# EAGLE design tec_controller_v4 (EAGLE 7.2.0)
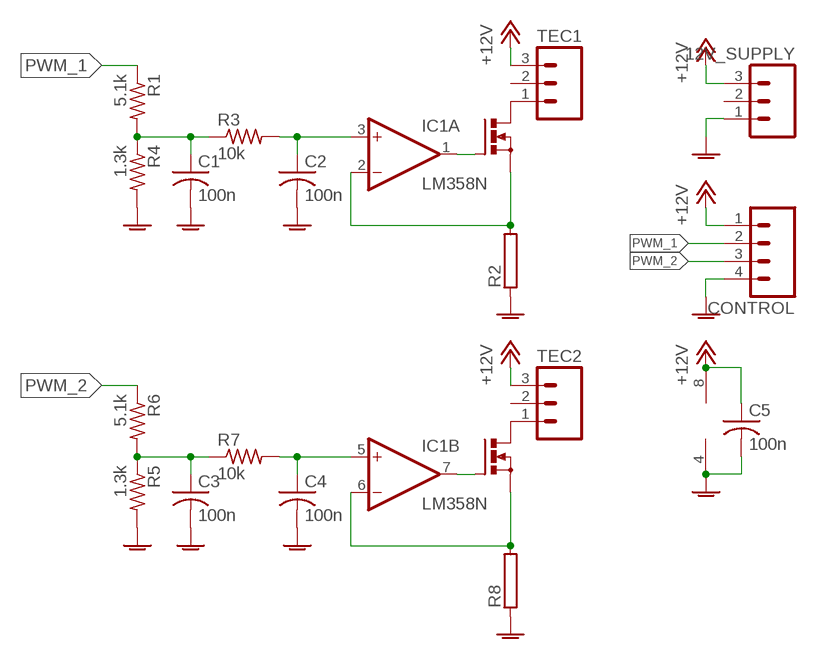
[diagram p0: schematic, sheet 1]

## Parts
12V_SUPPLY  M03POLAR  [MOLEX-1X3]
C1  100n  C-USC0805  [C0805]
C2  100n  C-USC0805  [C0805]
C3  100n  C-USC0805  [C0805]
C4  100n  C-USC0805  [C0805]
C5  100n  C-USC0805  [C0805]
CONTROL  M04POLAR  [MOLEX-1X4]
IC1  LM358N  [DIL08]
Q1  IRF512  [TO220BV]
Q2  IRF512  [TO220BV]
R1  5.1k  R-US_M0805  [M0805]
R2  RAC10  [AC10]
R3  10k  R-US_M0805  [M0805]
R4  1.3k  R-US_M0805  [M0805]
R5  1.3k  R-US_M0805  [M0805]
R6  5.1k  R-US_M0805  [M0805]
R7  10k  R-US_M0805  [M0805]
R8  RAC10  [AC10]
TEC1  M03POLAR  [MOLEX-1X3]
TEC2  M03POLAR  [MOLEX-1X3]

## Nets
+12V: 12V_SUPPLY.3 C5.1 CONTROL.1 IC1.8(P:V+) TEC1.3 TEC2.3
GNDA: 12V_SUPPLY.1 C1.2 C2.2 C3.2 C4.2 C5.2 CONTROL.4 IC1.4(P:V-) R2.1 R4.2 R5.2 R8.1
N$1: Q1.D TEC1.1
N$2: Q2.D TEC2.1
N$3: IC1.1(A:OUT) Q1.G
N$4: C1.1 R1.2 R3.1 R4.1
N$5: C2.1 IC1.3(A:+IN) R3.2
N$6: IC1.2(A:-IN) Q1.S R2.2
N$7: C3.1 R5.1 R6.2 R7.1
N$8: C4.1 IC1.5(B:+IN) R7.2
N$11: IC1.7(B:OUT) Q2.G
N$12: IC1.6(B:-IN) Q2.S R8.2
PWM_1: CONTROL.2 R1.1
PWM_2: CONTROL.3 R6.1
Unconnected: 12V_SUPPLY.2 TEC1.2 TEC2.2

## Library data of the parts
12V_SUPPLY TEC1 TEC2 = SparkFun-Connectors:M03: Header 3 Standard 3-pin 0.1" header. Use with straight break away headers (SKU : PRT-00116), right angle break away headers (PRT-00553), swiss pins (PRT-00743), machine pins (PRT-00117), and female headers (PRT-00115). Molex polarized connector foot print use with SKU : PRT-08232 with associated crimp pins and housings.
C1-C5 = rcl:C-US: CAPACITOR, American symbol
CONTROL = SparkFun-Connectors:M04: Header 4 Standard 4-pin 0.1" header. Use with straight break away headers (SKU : PRT-00116), right angle break away headers (PRT-00553), swiss pins (PRT-00743), machine pins (PRT-00117), and female headers (PRT-00115). Molex polarized connector foot print use with SKU : PRT-08231 with associated crimp pins and housings. 1MM SMD Version SKU: PRT-10208
IC1 = linear:LM358: OP AMP also LM158; LM258; LM2904 Source: http://cache.national.com/ds/LM/LM158.pdf
Q1 Q2 = transistor-power:IRF512: N-CHANNEL MOS FET
R1 R3-R7 = rcl:R-US_: RESISTOR, American symbol
R2 R8 = resistor-power:R: Power Resitor; OC_FARNELL: unknown; OC_NEWARK: unknown

## Board
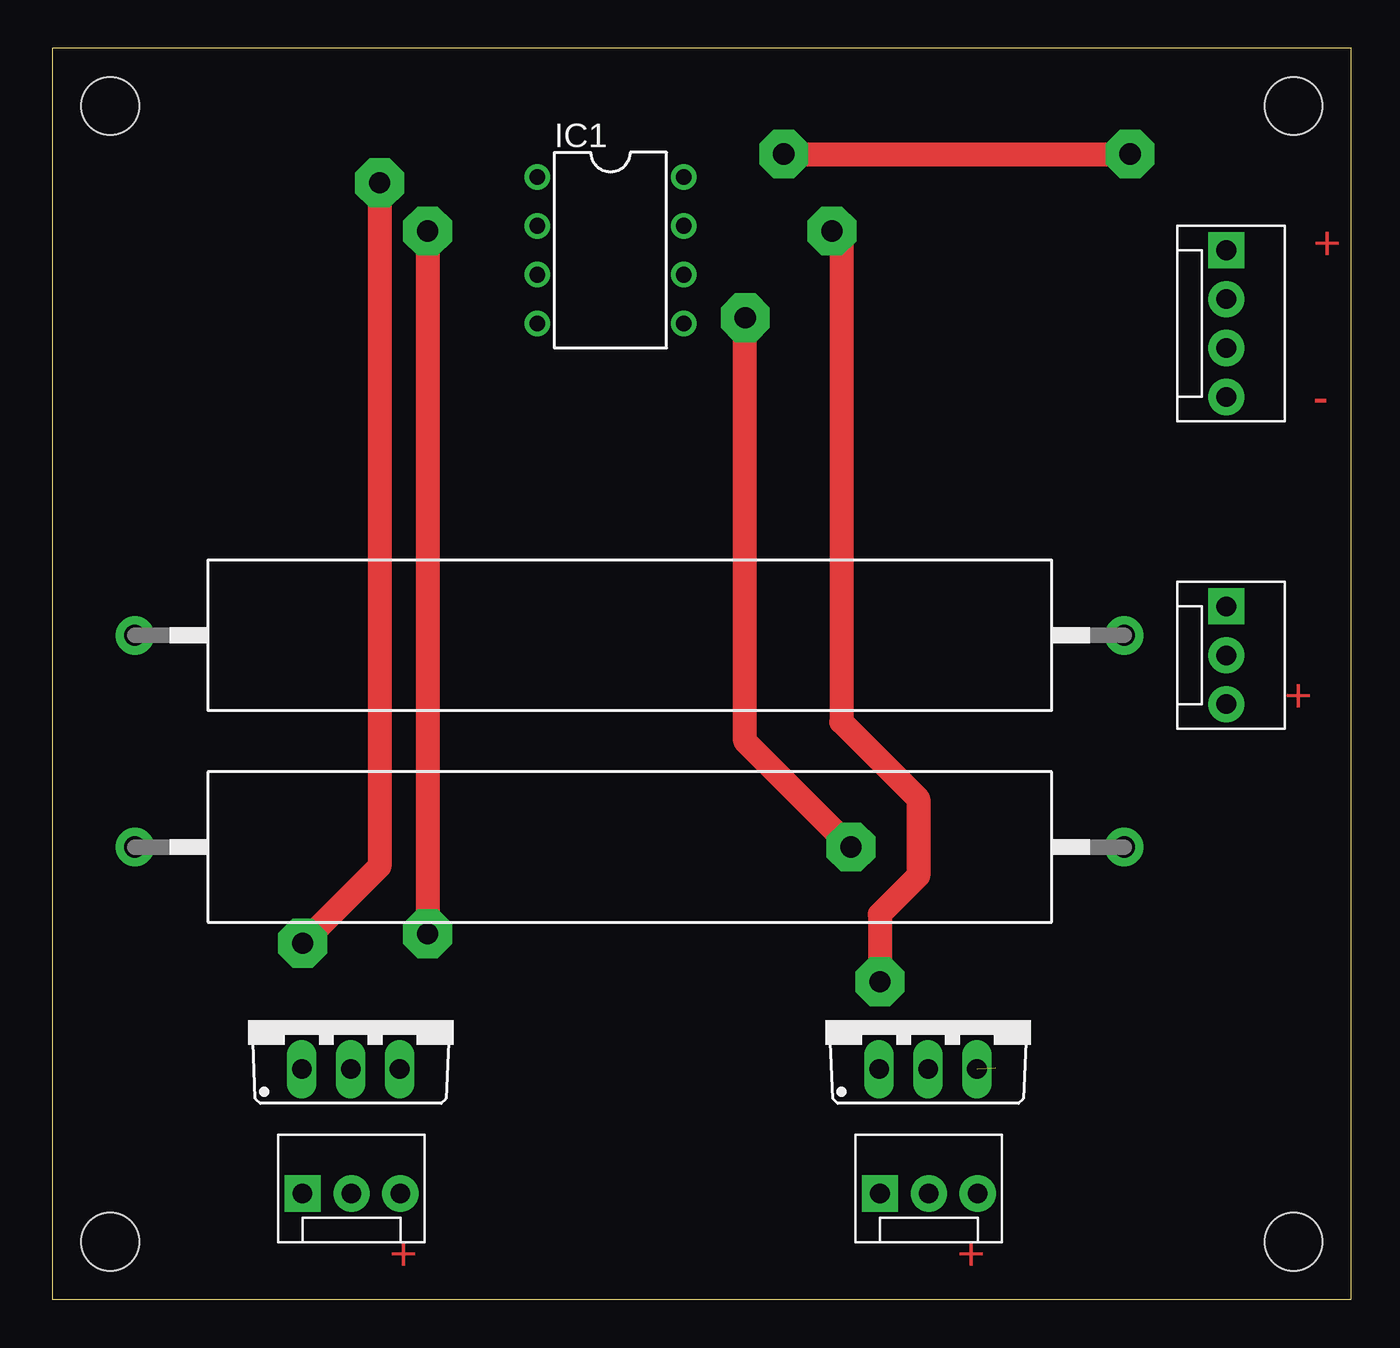
[diagram p1: board, top side]
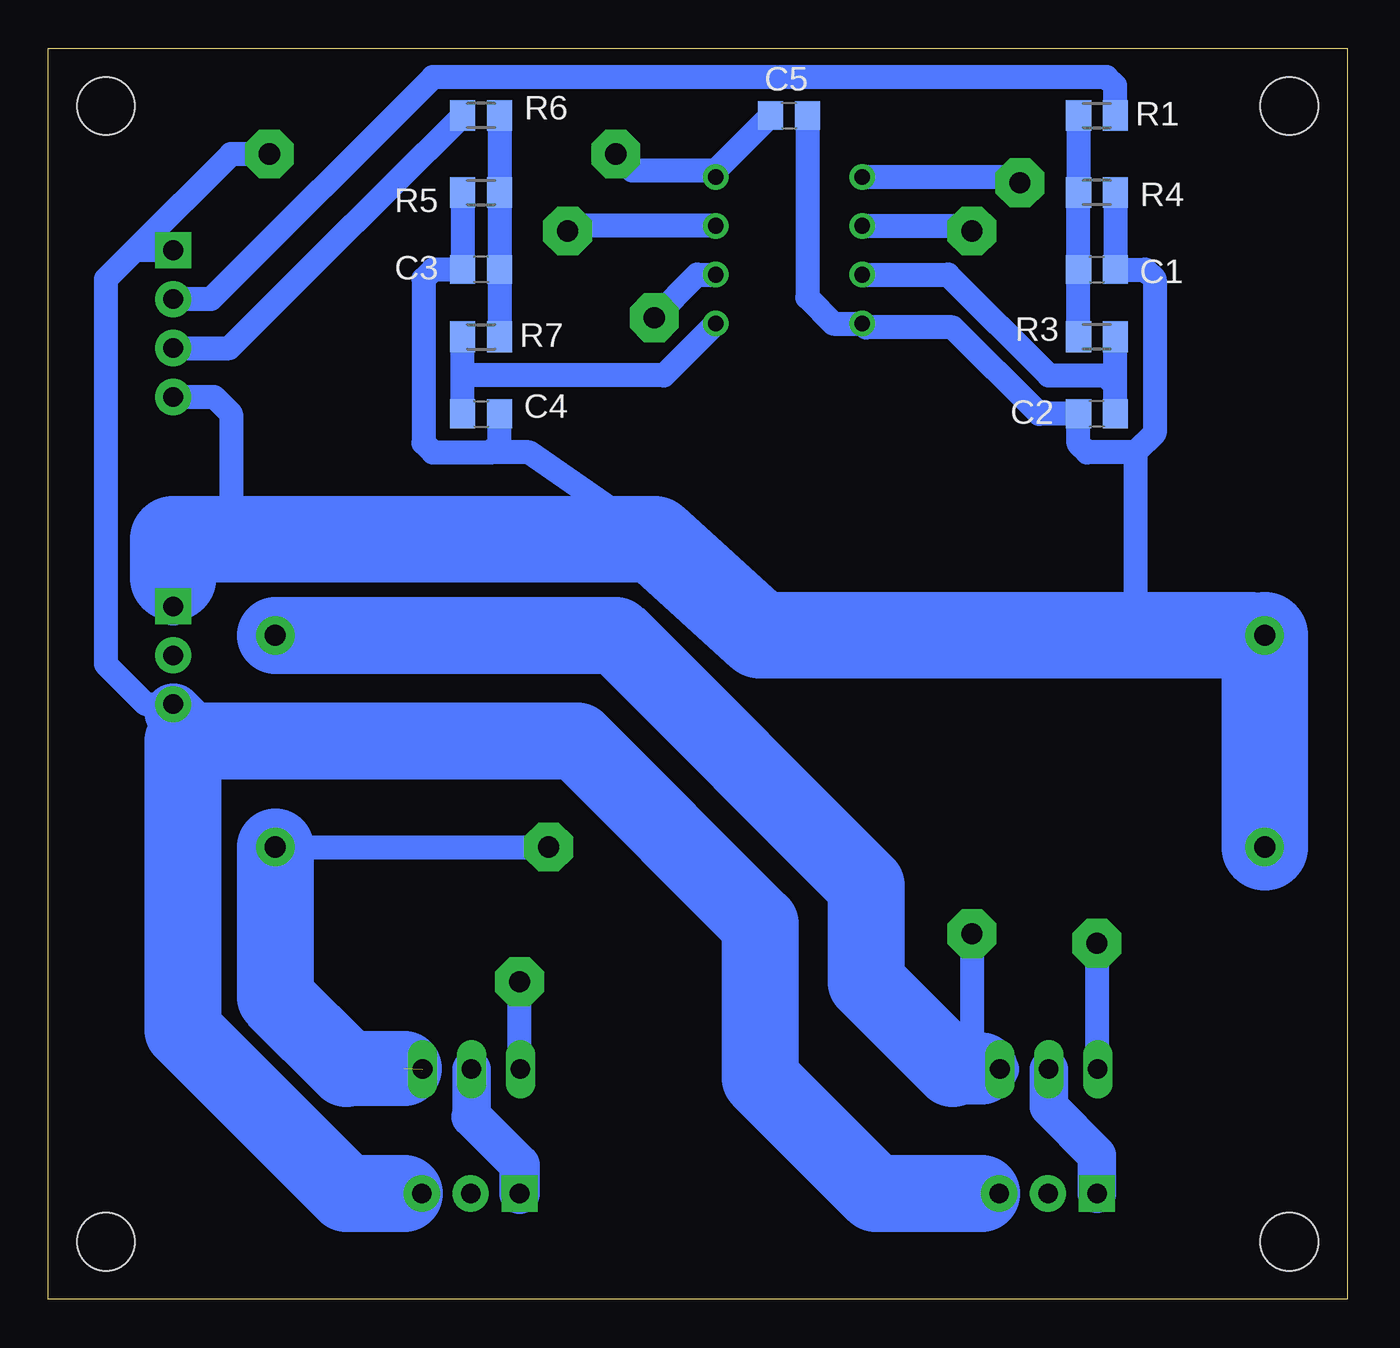
[diagram p2: board, bottom side, seen from below]

Size 67.5 x 65 mm. Coordinates in mm from the lower left corner, seen from the top.
Outline: 0,0 67.5,0 67.5,65 0,65 0,0
Copper layers (1*16): Top 0.035mm / dielectric 1.5mm / Bottom 0.035mm
Design rules "default *": minimum track width 10mil, minimum drill 24mil, track to track 20mil, track to pad 20mil, pad to pad 20mil, via to via 20mil, smd to smd 20mil, copper to edge 1mil, drill to drill 8mil, minimum pad ring 10mil, minimum via ring 8mil, stop-mask expansion 4mil, vias tented up to drill 0mil, thermal gap 10mil
Holes 3 mm at 3,62 64.5,62 64.5,3 3,3

### Footprints (pad centres in the part's own frame; a part is rotated, then mirrored left to right if it is on the bottom)
MOLEX-1X3 = drill 1.016 pad 1.88 square: 1 0,0 | drill 1.016 pad 1.88: 2 2.54,0; 3 5.08,0
C0805 = smd 1.3 x 1.5: 1 -0.95,0; 2 0.95,0
MOLEX-1X4 = drill 1.016 pad 1.88 square: 1 0,0 | drill 1.016 pad 1.88: 2 2.54,0; 3 5.08,0; 4 7.62,0
DIL08 = drill 0.813 pad 1.27: 1 -3.81,-3.81; 2 -1.27,-3.81; 3 1.27,-3.81; 4 3.81,-3.81; 5 3.81,3.81; 6 1.27,3.81; 7 -1.27,3.81; 8 -3.81,3.81
TO220BV = drill 1.016 long: D 0,-2.54; G -2.54,-2.54; S 2.54,-2.54
M0805 = smd 1.3 x 1.6: 1 -0.95,0; 2 0.95,0
AC10 = drill 1.1 pad 2: 1 -25.725,0; 2 25.7,0

### Placement (x,y rotation side)
12V_SUPPLY  61,36 270 top
C1  13,53.5 0 bottom
C2  13,46 180 bottom
C3  45,53.5 180 bottom
C4  45,46 0 bottom
C5  29,61.5 0 bottom
CONTROL  61,54.5 270 top
IC1  29,54.5 270 top
Q1  15.5,14.5 0 top
Q2  45.5,14.5 0 top
R1  13,61.5 180 bottom
R2  30,34.5 0 top
R3  13,50 0 bottom
R4  13,57.5 0 bottom
R5  45,57.5 180 bottom
R6  45,61.5 0 bottom
R7  45,50 180 bottom
R8  30,23.5 0 top
TEC1  13,5.5 0 top
TEC2  43,5.5 0 top

### Tracks (layer width: path | path; a pad name or v marks a point on that pad's centre or on a via)
+12V  (via drill 1.1 pad 2.54)
  Top 1.25: v38,59.5 v56,59.5
  Bottom 1.25: C5.1 32.81,58.64 | 32.81,58.64 IC1.8 | CONTROL.1 63,54.5 | 63,54.5 64.5,53 64.5,33 62.42,30.92 12V_SUPPLY.3 61,30.5 | 32.81,58.64 37.14,58.64 v38,59.5 | v56,59.5 58,59.5 63,54.5
  Bottom 2: TEC1.3 18.58,5 19,5.5 | TEC2.3 49,5.5
  Bottom 3: 60.5,29 60.5,30 61,30.5
  Bottom 4: 19,5.5 24.5,5.5 30.5,11.5 30.5,19.5 40,29 60.5,29 60.5,14 52,5.5 49,5.5
GNDA
  Bottom 1.25: R4.2 C1.2 10.5,53.5 10,53 10,45 11,44 | 11,44 13.5,44 13.95,44.45 C2.2 16,46 20.5,50.5 25,50.5 IC1.4 26.69,50.69 28.05,52.05 C5.2 | R5.2 C3.2 47.5,53.5 48,53 48,44.5 47.5,44 44.5,44 | 44.5,44 44.05,44.45 C4.2 | 36,39.5 42.5,44 44.5,44 | 11,44 11,34.5 | CONTROL.4 58.88,46.88 58,46 58,39.5
  Bottom 2: 61,37.5 12V_SUPPLY.1 | R2.1 5,34.5
  Bottom 4.5: R2.1 R8.1 | 61,37.5 61,39.5 58,39.5 36,39.5 30.5,34.5 11,34.5 5,34.5
N$1
  Bottom 2: TEC1.1 13,7.5 15.5,10 Q1.D
N$2
  Bottom 2: 45.5,9.5 Q2.D
  Bottom 2.1: TEC2.1 43,7 45.5,9.5
N$3  (via drill 1.1 pad 2.54)
  Top 1.25: v17,58 17,22.5 v13,18.5
  Bottom 1.25: IC1.1 17.31,58.31 v17,58 | v13,18.5 13,12 Q1.G
N$4
  Bottom 1.25: R1.2 R4.1 C1.1 R3.1
N$5
  Bottom 1.25: C2.1 12.05,47.5 | 12.05,47.5 R3.2 | IC1.3 20.73,53.23 15.5,48 12.55,48 12.05,47.5
N$6  (via drill 1.1 pad 2.54)
  Top 1.25: v19.5,55.5 v19.5,19
  Bottom 1.25: IC1.2 19.27,55.77 v19.5,55.5 | Q1.S 19.5,13.42 v19.5,19
  Bottom 2: 19,12 18.96,11.96 Q1.S
  Bottom 3.75: 20.5,12 19,12
  Bottom 4: R2.2 38,34.5 25,21.5 25,16.5 20.5,12
N$7
  Bottom 1.25: R6.2 R5.1 C3.1 R7.1
N$8
  Bottom 1.25: C4.1 45.95,48 | 45.95,48 R7.2 | IC1.5 35.5,48 45.95,48
N$11  (via drill 1.1 pad 2.54)
  Top 1.25: v40.5,55.5 41,55 41,30 45,26 45,22 43,20 v43,16.5
  Bottom 1.25: IC1.7 40.23,55.77 v40.5,55.5 | Q2.G 43,12 v43,16.5
N$12  (via drill 1.1 pad 2.54)  (1 unrouted)
  Top 1.25: v41.5,23.5 36,29 v36,51
  Bottom 1.25: R8.2 v41.5,23.5 | v36,51 33.77,53.23 IC1.6
  Bottom 1.9: 48.08,12 Q2.S
  Bottom 2: 48.5,12 48.08,12
  Bottom 3.9: 52,12 49,12
  Bottom 4: R8.2 55.7,15.7 52,12
PWM_1
  Bottom 1.25: R1.1 12.05,63.05 12.5,63.5 47.5,63.5 59.04,51.96 CONTROL.2
PWM_2
  Bottom 1.25: CONTROL.3 58.08,49.42 53.5,54 R6.1

### Text on the board
Top: + | - | + | + | +